# EAGLE design GPS_Breakout (EAGLE 6.4)
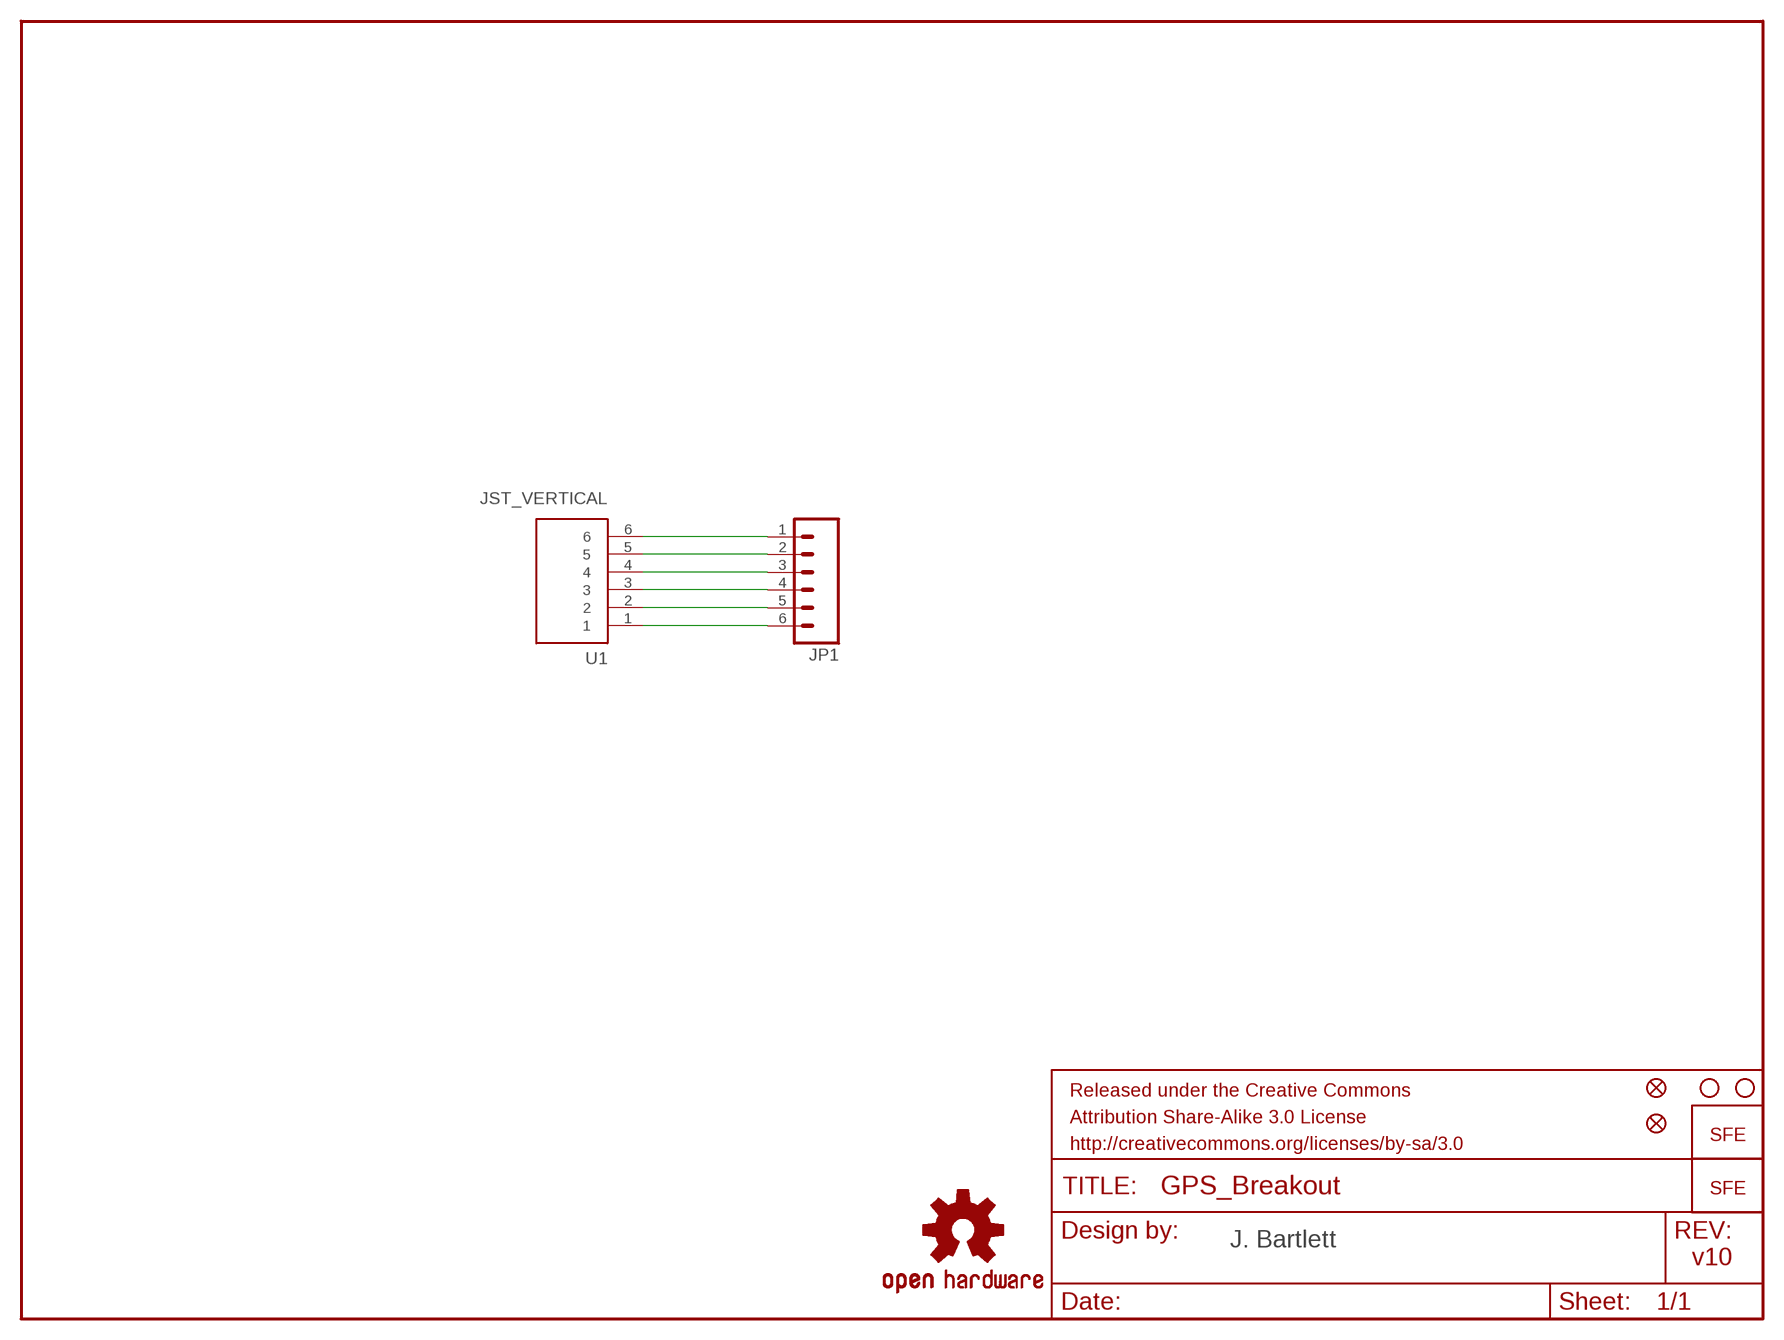
[diagram p0: schematic, sheet 1]

## Parts
FID1  FIDUCIALUFIDUCIAL  [MICRO-FIDUCIAL]
FID2  FIDUCIALUFIDUCIAL  [MICRO-FIDUCIAL]
FRAME2  FRAME-LETTER  [CREATIVE_COMMONS]
JP1  M06SIP  [1X06]
JP2  LOGO-SFESK  [SFE-LOGO-FLAME]
JP4  STAND-OFF  [STAND-OFF]
JP6  STAND-OFF  [STAND-OFF]
JP7  LOGO-SFESK  [SFE-LOGO-FLAME]
LOGO1  OSHW-LOGOS  [OSHW-LOGO-S]
U1  JST_VERTICAL  [JST-6-SMD-VERT-1.0MM]

## Nets
N$1: JP1.1 U1.6
N$2: JP1.2 U1.5
N$3: JP1.3 U1.4
N$4: JP1.4 U1.3
N$5: JP1.5 U1.2
N$6: JP1.6 U1.1

## Notes on the sheet
- J. Bartlett
- v10

## Library data of the parts
FID1 FID2 = SparkFun-Aesthetics:FIDUCIAL: Fiducial Alignment Points Various fiducial points for machine vision alignment.
FRAME2 = SparkFun-Aesthetics:FRAME-LETTER: Schematic Frame Standard 8.5x11 US Letter frame
JP1 = SparkFun-Connectors:M06: Header 6 Standard 6-pin 0.1" header. Use with straight break away headers (SKU : PRT-00116), right angle break away headers (PRT-00553), swiss pins (PRT-00743), machine pins (PRT-00117), and female headers (PRT-00115). Molex polarized connector foot print use with SKU : PRT-08094 with associated crimp pins and housings. NOTES ON THE VARIANTS LOCK and LOCK_LONGPADS... This footprint was designed to help hold the alignment of a through-hole component (i.e. 6-pin header) while soldering it into place. You may notice that each hole has been shifted either up or down by 0.005 of an inch from it's more standard position (which is a perfectly straight line). This slight alteration caused the pins (the squares in the middle) to touch the edges of the holes. Because they are alternating, it causes a "brace" to hold the component in place. 0.005 has proven to be the perfect amount of "off-center" position when using our standard breakaway headers. Although looks a little odd when you look at the bare footprint, once you have a header in there, the alteration is very hard to notice. Also, if you push a header all the way into place, it is covered up entirely on the bottom side. This idea of altering the position of holes to aid alignment will be further integrated into the Sparkfun Library for other footprints. It can help hold any component with 3 or more connection pins.
JP2 JP7 = SparkFun:LOGO-SFE: Spark Fun Electronics PCB Logo This is the standard Spark Fun Electronics PCB logo.
JP4 JP6 = SparkFun:STAND-OFF: Stand Off This is the mechanical footprint for a #4 phillips button head screw. Use the keepout ring to avoid running the screw head into surrounding components. SKU : PRT-00447
LOGO1 = SparkFun-Aesthetics:OSHW-LOGO: Open Source Hardware Logo This logo indicates the piece of hardware it is found on incorporates a OSHW license and/or adheres to the definition of open source hardware found here: http://freedomdefined.org/OSHW
U1 = SparkFun-Connectors:JST_VERTICAL

## Board
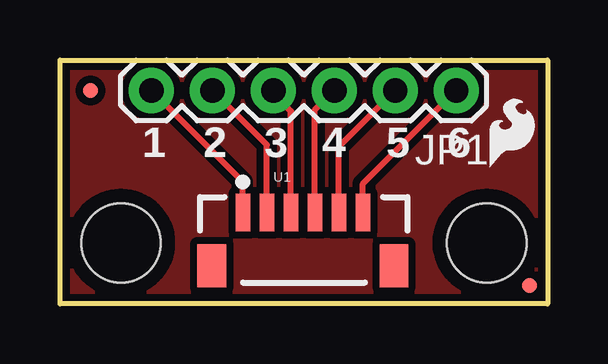
[diagram p1: board, top side]
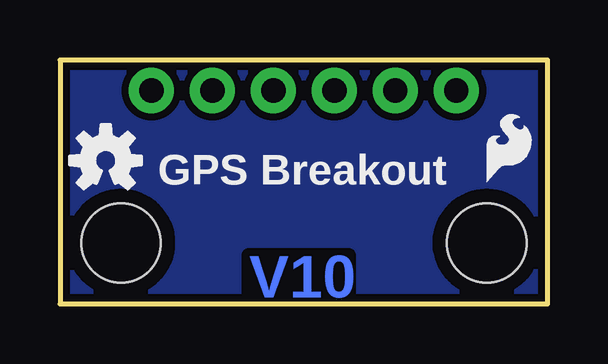
[diagram p2: board, bottom side, seen from below]

Size 20.32 x 10.16 mm. Coordinates in mm from the lower left corner, seen from the top.
Outline: 0,0 0,10.16 20.32,10.16 20.32,0 0,0
Copper layers (1*16): Top 0.035mm / dielectric 1.5mm / Bottom 0.035mm
Design rules "default": minimum track width 8mil, minimum drill 20mil, track to track 8mil, track to pad 8mil, pad to pad 8mil, via to via 8mil, smd to smd 8mil, copper to edge 8mil, drill to drill 8mil, minimum pad ring 12mil, minimum via ring 10mil, stop-mask expansion 4mil, vias tented up to drill 20mil, thermal gap 10mil

### Footprints (pad centres in the part's own frame; a part is rotated, then mirrored left to right if it is on the bottom)
MICRO-FIDUCIAL = smd 0.635 x 0.635: 1 0,0
1X06 = drill 1.016 pad 1.88: 1 0,0; 2 2.54,0; 3 5.08,0; 4 7.62,0; 5 10.16,0; 6 12.7,0
STAND-OFF = hole 3.302: 0,0
JST-6-SMD-VERT-1.0MM = smd 0.6 x 1.55: 1 -2.54,1.27; 2 -1.54,1.27; 3 -0.54,1.27; 4 0.46,1.27; 5 1.46,1.27; 6 2.46,1.27 | smd 1.2 x 1.8: P$1 -3.84,-0.955; P$2 3.76,-0.955

### Placement (x,y rotation side)
FID1  19.56,0.76 0 top
FID2  1.27,8.89 0 top
FRAME2  19.05,-8.89 0 top  (outside the outline)
JP1  16.51,8.89 180 top
JP2  17.91,5.71 0 top
JP4  2.54,2.54 0 top
JP6  17.78,2.54 0 top
JP7  2.54,5.08 0 bottom
LOGO1  18.41,5.97 0 bottom
U1  10.16,2.54 0 top

### Tracks (layer width: path | path; a pad name or v marks a point on that pad's centre or on a via)
GND
  pour Bottom (isolate 0.305): 0,0 0,10.16 20.32,10.16 20.32,0
  pour Top (isolate 0.305): 0,0 0,10.16 20.32,10.16 20.32,0
N$1
  Top 0.254: U1.6 12.62,5 JP1.1
N$2
  Top 0.254: U1.5 11.62,6.54 JP1.2
N$3
  Top 0.254: U1.4 10.62,8.08 JP1.3
N$4
  Top 0.254: U1.3 9.62,8.03 8.89,8.76 JP1.4
N$5
  Top 0.254: U1.2 8.62,6.62 JP1.5
N$6
  Top 0.254: U1.1 7.62,5.08 JP1.6

### Text on the board
Bottom: V10
tPlace: 1 | 2 | 3 | 4 | 5 | 6
bPlace: GPS Breakout
tValues: J. Bartlett